# EAGLE schematic diffamp (EAGLE 8.3.1)
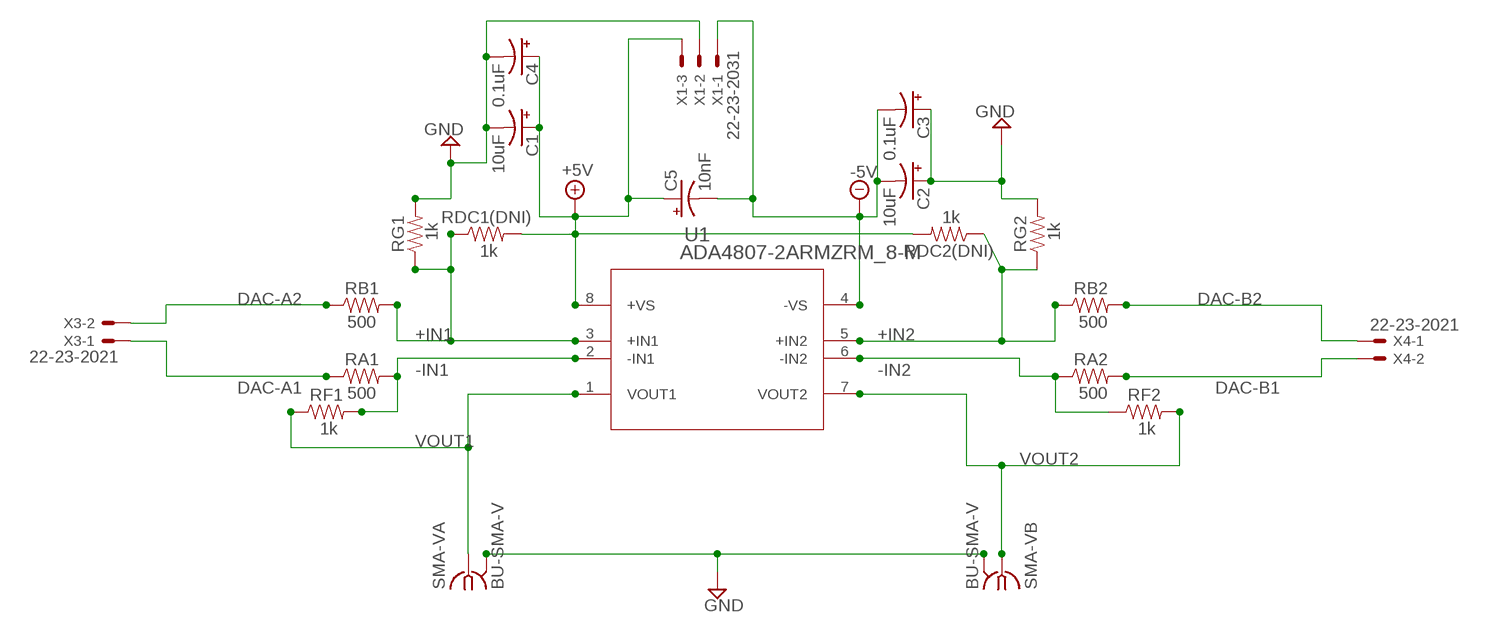
[diagram p0: schematic, sheet 1]

## Parts
C1  10uF  10UF-POLAR-RADIAL-2.5MM-25V-20%  [CPOL-RADIAL-2.5MM-5MM]
C2  10uF  10UF-POLAR-RADIAL-2.5MM-25V-20%  [CPOL-RADIAL-2.5MM-5MM]
C3  0.1uF  10UF-POLAR-RADIAL-2.5MM-25V-20%  [CPOL-RADIAL-2.5MM-5MM]
C4  0.1uF  10UF-POLAR-RADIAL-2.5MM-25V-20%  [CPOL-RADIAL-2.5MM-5MM]
C5  10nF  10UF-POLAR-RADIAL-2.5MM-25V-20%  [CPOL-RADIAL-2.5MM-5MM]
RA1  500  RESISTORAXIAL-0.3  [AXIAL-0.3]
RA2  500  RESISTORAXIAL-0.3  [AXIAL-0.3]
RB1  500  RESISTORAXIAL-0.3  [AXIAL-0.3]
RB2  500  RESISTORAXIAL-0.3  [AXIAL-0.3]
RDC1(DNI)  1k  RESISTORAXIAL-0.3  [AXIAL-0.3]
RDC2(DNI)  1k  RESISTORAXIAL-0.3  [AXIAL-0.3]
RF1  1k  RESISTORAXIAL-0.3  [AXIAL-0.3]
RF2  1k  RESISTORAXIAL-0.3  [AXIAL-0.3]
RG1  1k  RESISTORAXIAL-0.3  [AXIAL-0.3]
RG2  1k  RESISTORAXIAL-0.3  [AXIAL-0.3]
SMA-VA  BU-SMA-V  [BU-SMA-V]
SMA-VB  BU-SMA-V  [BU-SMA-V]
U1  ADA4807-2ARMZRM_8-M  [RM_8-M]
X1  22-23-2031  [22-23-2031]
X3  22-23-2021  [22-23-2021]
X4  22-23-2021  [22-23-2021]

## Nets
+5V: C1.1(+) C4.1(+) C5.1(+) RDC1(DNI).P$2 RDC2(DNI).P$2 U1.8(+VS) X1.3
+IN1: RB1.P$2 RDC1(DNI).P$1 RG1.P$1 U1.3(+IN1)
+IN2: RB2.P$1 RDC2(DNI).P$1 RG2.P$1 U1.5(+IN2)
-5V: C2.2(-) C3.2(-) C5.2(-) U1.4(-VS) X1.1
-IN1: RA1.P$2 RF1.P$2 U1.2(-IN1)
-IN2: RA2.P$1 RF2.P$1 U1.6(-IN2)
DAC-A1: RA1.P$1 X3.1
DAC-A2: RB1.P$1 X3.2
DAC-B1: RA2.P$2 X4.2
DAC-B2: RB2.P$2 X4.1
GND: C1.2(-) C2.1(+) C3.1(+) C4.2(-) RG1.P$2 RG2.P$2 SMA-VA.2 SMA-VA.3 SMA-VA.4 SMA-VA.5 SMA-VB.2 SMA-VB.3 SMA-VB.4 SMA-VB.5 X1.2
VOUT1: RF1.P$1 SMA-VA.1 U1.1(VOUT1)
VOUT2: RF2.P$2 SMA-VB.1 U1.7(VOUT2)

## Library data of the parts
C1 C2 = SparkFun-Capacitors:10UF-POLAR: 10.0µF polarized capacitors A capacitor is a passive two-terminal electrical component used to store electrical energy temporarily in an electric field.; PROD_ID: CAP-08440
C3-C5 = SparkFun-Capacitors:10UF-POLAR: 10.0µF polarized capacitors A capacitor is a passive two-terminal electrical component used to store electrical energy temporarily in an electric field.; PROD_ID: CAP-08440; VALUE: 10uF
RA1 RA2 RB1 RB2 RDC1(DNI) RDC2(DNI) RF1 RF2 RG1 RG2 = SparkFun-Resistors:RESISTOR: Generic Resistor Package
SMA-VA SMA-VB = con-coax:BU-SMA-V: FEMALE SMA CONNECTOR Radiall distributor RS 112-3794; OC_FARNELL: unknown; OC_NEWARK: unknown
U1 = ADA4807-2:ADA4807-2ARMZ: Eagle Library for ADA4807-2 Block (ADA4807-2ARMZ-ND, 8MSOP); MANUFACTURER_PART_NUMBER: ADA48072ARMZ; VENDOR: Analog Devices Inc
X1 = con-molex:22-23-2031: .100" (2.54mm) Center Header - 3 Pin; MF: MOLEX; MPN: 22-23-2031; OC_FARNELL: 1462950; OC_NEWARK: 30C0862
X3 X4 = con-molex:22-23-2021: .100" (2.54mm) Center Header - 2 Pin; MF: MOLEX; MPN: 22-23-2021; OC_FARNELL: 1462926; OC_NEWARK: 25C3832